# Altium schematic sheet Crpto01JTAG.SchDoc
size A
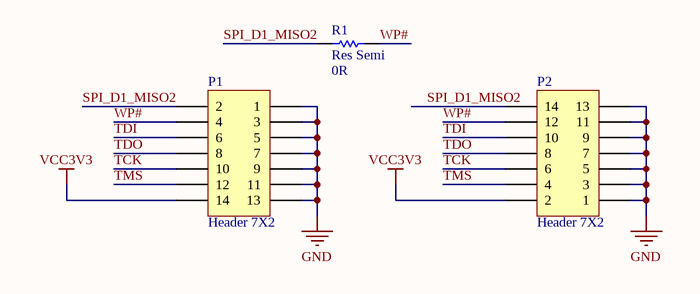
[diagram p0: Crpto01JTAG.SchDoc]

## Parts
P1  Header 7X2  [JTAG_WM9059CT-ND]
P2  Header 7X2  [2x7_2.0mm_Header]
R1  Res Semi  value 0R  [0402]

## Nets
GND: P1.1 P1.3 P1.5 P1.7 P1.9 P1.11 P1.13 P2.1 P2.3 P2.5 P2.7 P2.9 P2.11 P2.13
VCC3V3: P1.14 P2.2
SPI_D1_MISO2: P1.2 P2.14 R1.1
TCK: P1.10 P2.6
TDI: P1.6 P2.10
TDO: P1.8 P2.8
TMS: P1.12 P2.4
WP#: P1.4 P2.12 R1.2

## Library data of the parts
P1 P2 = Header 7X2: Header, 7-Pin, Dual row; LatestRevisionDate: 17-Jul-2002; LatestRevisionNote: Re-released for DXP Platform.; Publisher: Altium Limited
R1 = Res Semi: Semiconductor Resistor; Published: 8-Jun-2000; LatestRevisionDate: 17-Jul-2002; LatestRevisionNote: Re-released for DXP Platform.; PackageReference: AXIAL-0.5; Publisher: Altium Limited; PackageDescription: Axial Device, Thru-Hole; 2 Leads; 0.5 in Pin Spacing